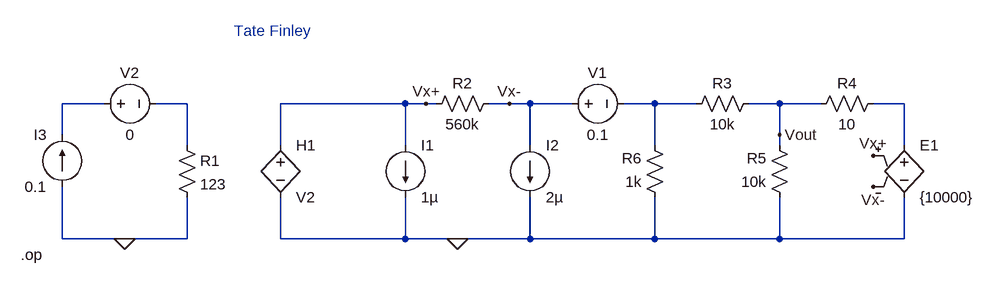
[diagram p0: schematic DependentSources.asc]
DependentSources.asc, the LTspice schematic file:
Version 4
SHEET 1 1424 680
WIRE 64 160 0 160
WIRE 192 160 144 160
WIRE 528 160 336 160
WIRE 560 160 528 160
WIRE 576 160 560 160
WIRE 688 160 656 160
WIRE 720 160 688 160
WIRE 784 160 720 160
WIRE 912 160 864 160
WIRE 976 160 912 160
WIRE 1104 160 1056 160
WIRE 1168 160 1104 160
WIRE 1296 160 1248 160
WIRE 0 208 0 160
WIRE 1104 208 1104 160
WIRE 192 224 192 160
WIRE 336 224 336 160
WIRE 528 224 528 160
WIRE 720 224 720 160
WIRE 912 224 912 160
WIRE 1104 224 1104 208
WIRE 1296 224 1296 160
WIRE 0 368 0 288
WIRE 96 368 0 368
WIRE 192 368 192 304
WIRE 192 368 96 368
WIRE 336 368 336 304
WIRE 528 368 528 304
WIRE 528 368 336 368
WIRE 608 368 528 368
WIRE 720 368 720 304
WIRE 720 368 608 368
WIRE 912 368 912 304
WIRE 912 368 720 368
WIRE 1104 368 1104 304
WIRE 1104 368 912 368
WIRE 1296 368 1296 304
WIRE 1296 368 1104 368
FLAG 608 368 0
FLAG 96 368 0
FLAG 560 160 Vx+
FLAG 1248 240 Vx+
FLAG 688 160 Vx-
FLAG 1248 288 Vx-
FLAG 1104 208 Vout
SYMBOL res 176 208 R0
SYMATTR InstName R1
SYMATTR Value 123
SYMBOL res 672 144 R90
WINDOW 0 0 56 VBottom 2
WINDOW 3 32 56 VTop 2
SYMATTR InstName R2
SYMATTR Value 560k
SYMBOL res 1072 144 R90
WINDOW 0 0 56 VBottom 2
WINDOW 3 32 56 VTop 2
SYMATTR InstName R3
SYMATTR Value 10k
SYMBOL res 1264 144 R90
WINDOW 0 0 56 VBottom 2
WINDOW 3 32 56 VTop 2
SYMATTR InstName R4
SYMATTR Value 10
SYMBOL res 1120 320 R180
WINDOW 0 36 76 Left 2
WINDOW 3 36 40 Left 2
SYMATTR InstName R5
SYMATTR Value 10k
SYMBOL res 928 320 R180
WINDOW 0 36 76 Left 2
WINDOW 3 36 40 Left 2
SYMATTR InstName R6
SYMATTR Value 1k
SYMBOL voltage 768 160 R270
WINDOW 0 32 56 VTop 2
WINDOW 3 -32 56 VBottom 2
WINDOW 123 0 0 Left 0
WINDOW 39 0 0 Left 0
SYMATTR InstName V1
SYMATTR Value 0.1
SYMBOL voltage 48 160 R270
WINDOW 0 32 56 VTop 2
WINDOW 3 -32 56 VBottom 2
WINDOW 123 0 0 Left 0
WINDOW 39 0 0 Left 0
SYMATTR InstName V2
SYMATTR Value 0
SYMBOL current 528 224 R0
WINDOW 123 0 0 Left 0
WINDOW 39 0 0 Left 0
SYMATTR InstName I1
SYMATTR Value 1µ
SYMBOL current 720 224 R0
WINDOW 123 0 0 Left 0
WINDOW 39 0 0 Left 0
SYMATTR InstName I2
SYMATTR Value 2µ
SYMBOL current 0 288 R180
WINDOW 0 24 80 Left 2
WINDOW 3 24 0 Left 2
WINDOW 123 0 0 Left 0
WINDOW 39 0 0 Left 0
SYMATTR InstName I3
SYMATTR Value 0.1
SYMBOL e 1296 208 R0
SYMATTR InstName E1
SYMATTR Value {10000}
SYMBOL h 336 208 R0
SYMATTR InstName H1
SYMATTR Value V2
SYMATTR Value2 10
TEXT 264 48 Left 2 ;Tate Finley
TEXT -64 392 Left 2 !.op

The netlist it stands for:
* DependentSources.asc
R1 N002 0 123
R2 Vx- Vx+ 560k
R3 Vout N003 10k
R4 N004 Vout 10
R5 0 Vout 10k
R6 0 N003 1k
V1 Vx- N003 0.1
V2 N001 N002 0
I1 Vx+ 0 1µ
I2 Vx- 0 2µ
I3 0 N001 0.1
E1 N004 0 Vx+ Vx- {10000}
H1 Vx+ 0 V2 10
* Tate Finley
.op
.backanno
.end